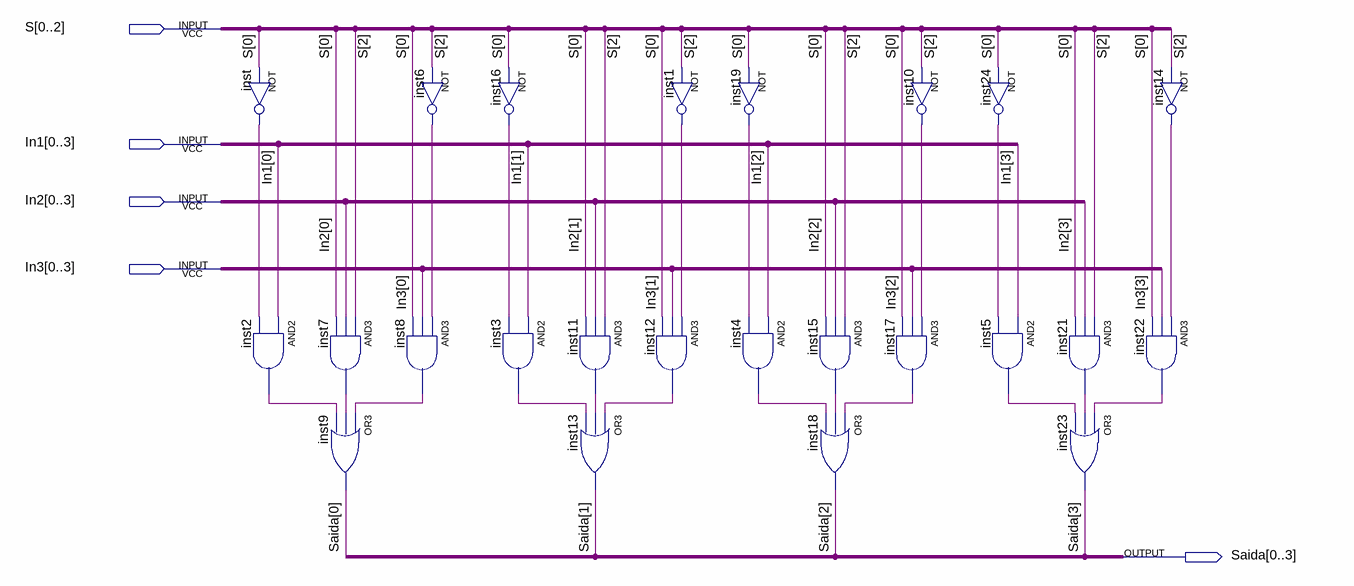
[diagram p0: schematic sheet]
// Quartus schematic multiRes.bdf as structural Verilog: 24 symbols, 5 pins
module multiRes (
  input  [0:2] S,
  input  [0:3] In1,
  input  [0:3] In2,
  input  [0:3] In3,
  output [0:3] Saida
);

  wire inst1_out, inst2_out, inst3_out, inst4_out, inst5_out, inst6_out, inst7_out, inst8_out, inst10_out,
       inst11_out, inst12_out, inst14_out, inst15_out, inst16_out, inst17_out, inst19_out, inst21_out,
       inst22_out, inst24_out, inst_out;

  not inst (inst_out, S[0]);
  and inst2 (inst2_out, In1[0], inst_out);
  and inst7 (inst7_out, S[2], In2[0], S[0]);
  or inst9 (Saida[0], inst8_out, inst7_out, inst2_out);
  and inst8 (inst8_out, inst6_out, In3[0], S[0]);
  not inst6 (inst6_out, S[2]);
  not inst16 (inst16_out, S[0]);
  and inst3 (inst3_out, In1[1], inst16_out);
  and inst11 (inst11_out, S[2], In2[1], S[0]);
  or inst13 (Saida[1], inst12_out, inst11_out, inst3_out);
  not inst1 (inst1_out, S[2]);
  and inst12 (inst12_out, inst1_out, In3[1], S[0]);
  not inst19 (inst19_out, S[0]);
  and inst4 (inst4_out, In1[2], inst19_out);
  and inst15 (inst15_out, S[2], In2[2], S[0]);
  or inst18 (Saida[2], inst17_out, inst15_out, inst4_out);
  not inst10 (inst10_out, S[2]);
  and inst17 (inst17_out, inst10_out, In3[2], S[0]);
  not inst24 (inst24_out, S[0]);
  and inst5 (inst5_out, In1[3], inst24_out);
  and inst21 (inst21_out, S[2], In2[3], S[0]);
  or inst23 (Saida[3], inst22_out, inst21_out, inst5_out);
  not inst14 (inst14_out, S[2]);
  and inst22 (inst22_out, inst14_out, In3[3], S[0]);
endmodule
